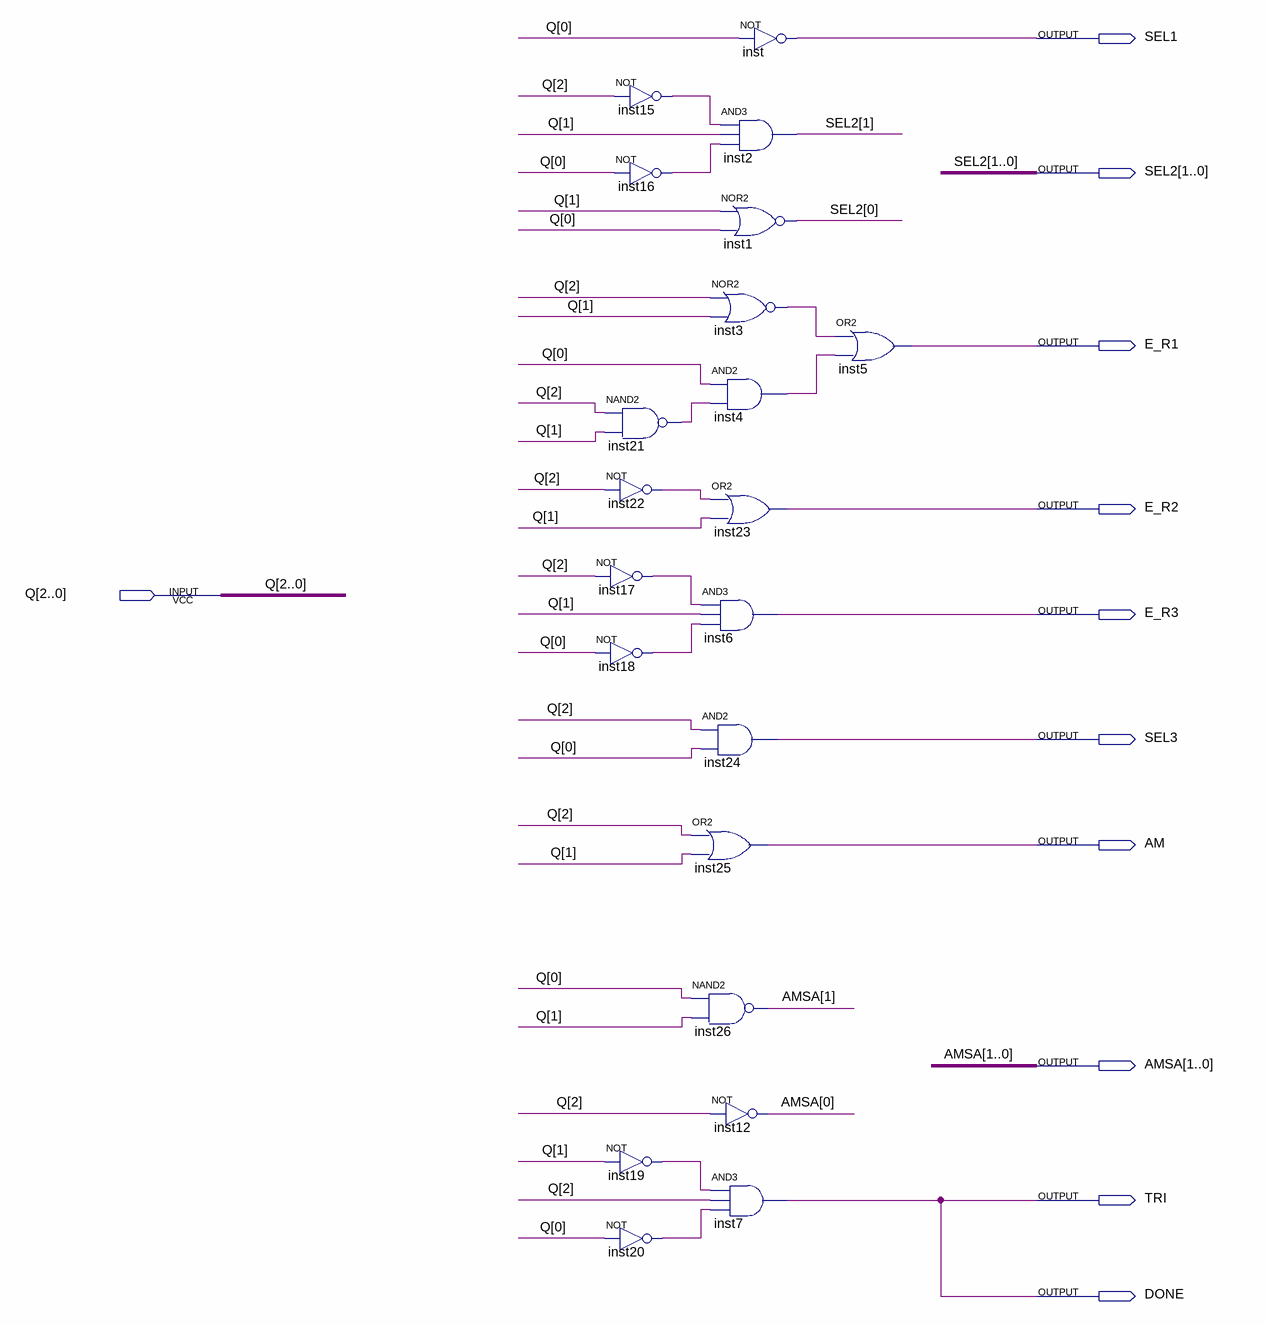
[diagram p0: schematic sheet]
// Quartus schematic OUTPUT.bdf as structural Verilog: 21 symbols, 11 pins
module OUTPUT (
  input  [2:0] Q,
  output SEL1,
  output [1:0] SEL2,
  output E_R1,
  output E_R2,
  output E_R3,
  output SEL3,
  output AM,
  output [1:0] AMSA,
  output TRI,
  output DONE
);

  wire inst3_out, inst4_out, inst15_out, inst16_out, inst17_out, inst18_out, inst19_out, inst20_out,
       inst21_out, inst22_out;

  not inst15 (inst15_out, Q[2]);
  not inst16 (inst16_out, Q[0]);
  nand inst21 (inst21_out, Q[2], Q[1]);
  not inst22 (inst22_out, Q[2]);
  not inst17 (inst17_out, Q[2]);
  not inst18 (inst18_out, Q[0]);
  not inst19 (inst19_out, Q[1]);
  not inst20 (inst20_out, Q[0]);
  and inst2 (SEL2[1], inst15_out, Q[1], inst16_out);
  nor inst1 (SEL2[0], Q[1], Q[0]);
  nor inst3 (inst3_out, Q[2], Q[1]);
  and inst4 (inst4_out, Q[0], inst21_out);
  or inst23 (E_R2, inst22_out, Q[1]);
  and inst6 (E_R3, inst17_out, Q[1], inst18_out);
  and inst24 (SEL3, Q[2], Q[0]);
  or inst25 (AM, Q[2], Q[1]);
  nand inst26 (AMSA[1], Q[0], Q[1]);
  not inst12 (AMSA[0], Q[2]);
  and inst7 (DONE, inst19_out, Q[2], inst20_out);
  not inst (SEL1, Q[0]);
  or inst5 (E_R1, inst3_out, inst4_out);

  assign TRI = DONE;
endmodule
